# EAGLE schematic easySens-RS485-RND_455-00307-V002 (EAGLE 7.6.0)
MAPLE-CUx Large Version
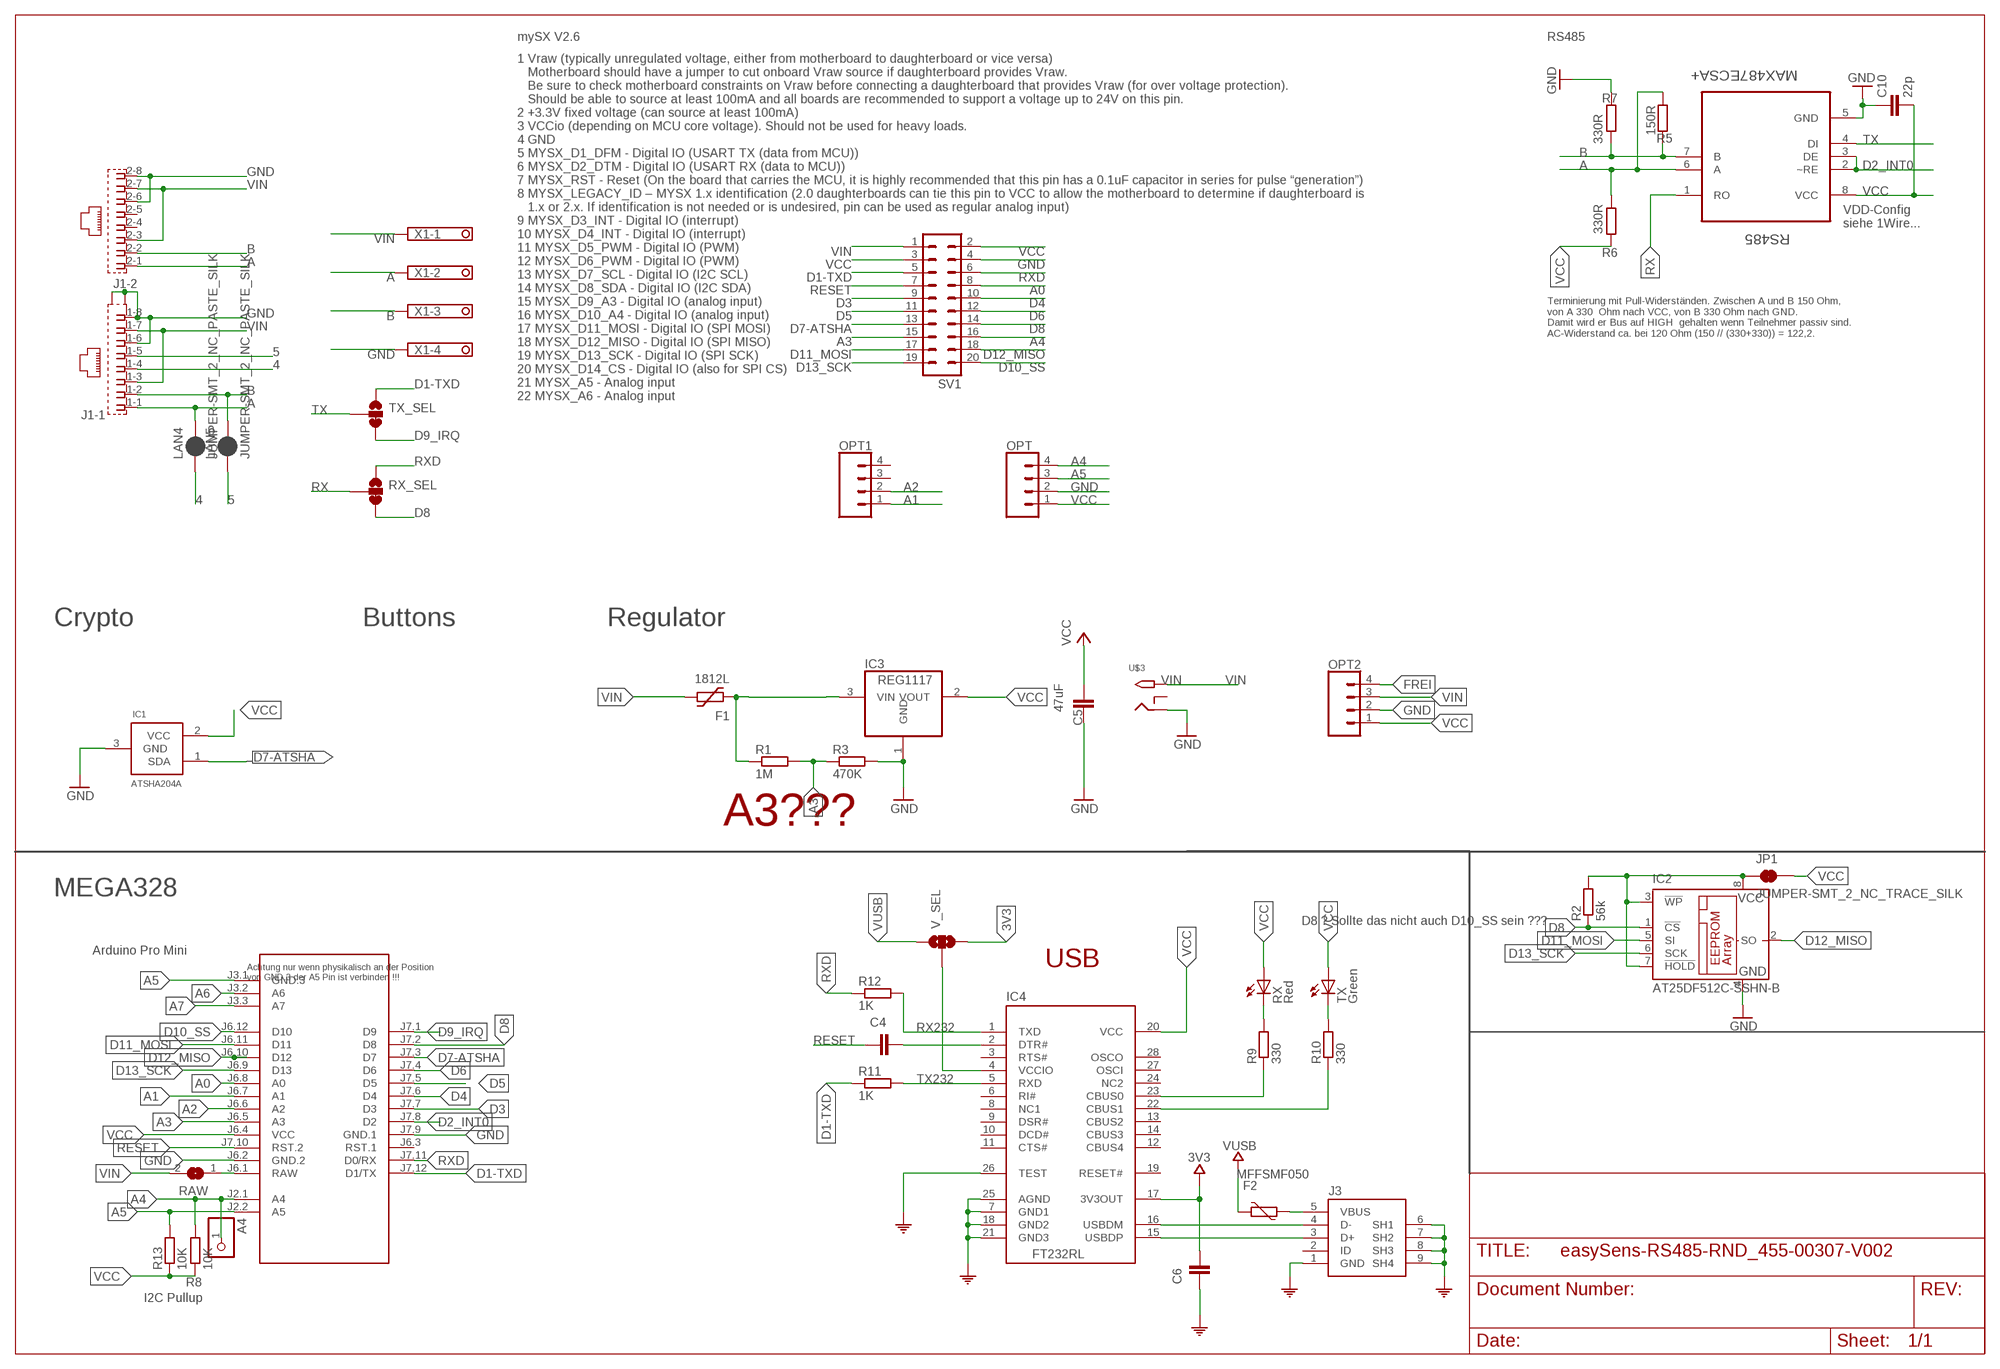
[diagram p0: schematic, sheet 1]

## Parts
A4  PINHD-1X1  [1X01]
C4  100nF  C-EUC0805  [C0805]
C5  47uF  C-EUC1210  [C1210]
C6  100nF  C-EUC0805  [C0805]
C10  22p  C-EUC0805  [C0805]
F1  1812L  [1812L]
F2  MFFSMF050  PTC  [0603-1608X90N]
IC1  ATSHA204A  [SOT23]
IC2  AT25DF512C-SSHN-B  25AA080SN  [SO-08]
IC3  REG1117  [SOT223]
IC4  FT232RL  0226_FT232RL  [SSOP28]
J1  RJ45_2X_NARROW_SHILDPINS  [RJ45_2X_NARROW_SHILDPINS]
J3  0219_14850  [USB-MINI-B_2]
JP1  JUMPER-SMT_2_NC_TRACE_SILK  [SMT-JUMPER_2_NC_TRACE_SILK]
LAN4  JUMPER-SMT_2_NC_PASTE_SILK  [SMT-JUMPER_2_NC_PASTE_SILK]
LAN5  JUMPER-SMT_2_NC_PASTE_SILK  [SMT-JUMPER_2_NC_PASTE_SILK]
M1  ARDUINO-PRO-MINI-3.3V#NP  [ARDUINO-PRO-MINI#NP]
OPT  CONN_04  [1X04]
OPT1  CONN_04  [1X04]
OPT2  CONN_04  [1X04]
R1  1M  R-EU_M0805  [M0805]
R2  56k  R-EU_M0805  [M0805]
R3  470K  R-EU_R0805  [R0805]
R5  150R  R-EU_R0805  [R0805]
R6  330R  R-EU_R0805  [R0805]
R7  330R  R-EU_R0805  [R0805]
R8  10K  R-EU_R0805  [R0805]
R9  330  R-EU_R0805  [R0805]
R10  330  R-EU_R0805  [R0805]
R11  1K  R-EU_R0805  [R0805]
R12  1K  R-EU_R0805  [R0805]
R13  10K  R-EU_R0805  [R0805]
RAW  SJ  [SJ]
RS485  MAX487ECSA+  [SOIC127P600X175-8N]
RX  Red  0181_KTP-2012SURCK  [CHIPLED_0805]
RX_SEL  JUMPER-SMT_3_1-NC_TRACE_SILK  [SMT-JUMPER_3_1-NC_TRACE_SILK]
SV1  MA10-2  [MA10-2]
TX  Green  0043_KPT-2012SGC  [CHIPLED_0805]
TX_SEL  JUMPER-SMT_3_1-NC_TRACE_SILK  [SMT-JUMPER_3_1-NC_TRACE_SILK]
U$3  2.1MMJACKTHM  [PJ-102A]
V_SEL  JUMPER-SMT_3_NO_SILK  [SMT-JUMPER_3_NO_SILK]
X1  1751264  [1751264]

## Nets
3V3: C6.2 IC4.17(3V3OUT) V_SEL.3
4: J1.1-4 LAN4.1
5: J1.1-5 LAN5.1
A: J1.1-1 J1.2-1 LAN4.2 R5.1 R6.2 RS485.6(A) X1.2
A0: M1.J6.8(A0) SV1.8
A1: M1.J6.7(A1) OPT1.1
A2: M1.J6.6(A2) OPT1.2
A3: M1.J6.5(A3) R1.2 R3.1 SV1.15
A4: A4.1 M1.J2.1(A4) OPT.4 R8.2 SV1.16
A5: M1.J2.2(A5) M1.J3.1(GND.3) OPT.3 R13.2
A6: M1.J3.2(A6)
A7: M1.J3.3(A7)
B: J1.1-2 J1.2-2 LAN5.2 R5.2 R7.1 RS485.7(B) X1.3
COM: C6.1 IC4.7(GND1) IC4.18(GND2) IC4.21(GND3) IC4.25(AGND) IC4.26(TEST) J3.1(GND) J3.6(SH1) J3.7(SH2) J3.8(SH3) J3.9(SH4)
D1-TXD: M1.J7.12(D1/TX) R11.1 SV1.5 TX_SEL.1
D2_INT0: M1.J7.8(D2) RS485.2(~RE) RS485.3(DE)
D3: M1.J7.7(D3) SV1.9
D4: M1.J7.6(D4) SV1.10
D5: M1.J7.5(D5) SV1.11
D6: M1.J7.4(D6) SV1.12
D7-ATSHA: IC1.1(SDA) M1.J7.3(D7) SV1.13
D8: IC2.1(!CS) M1.J7.2(D8) R2.1 RX_SEL.3 SV1.14
D9_IRQ: M1.J7.1(D9) TX_SEL.3
D10_SS: M1.J6.12(D10) SV1.20
D11_MOSI: IC2.5(SI) M1.J6.11(D11) SV1.17
D12_MISO: IC2.2(SO) M1.J6.10(D12) SV1.18
D13_SCK: IC2.6(SCK) M1.J6.9(D13) SV1.19
FREI: OPT2.4
GND [PWR]: C5.1 C10.1 IC1.3(GND) IC2.4(GND) IC3.1(GND) J1.1-6 J1.1-8 J1.2-6 J1.2-8 J1.G1(-1:S1) J1.G3(-1:S2) M1.J6.2(GND.2) M1.J7.9(GND.1) OPT2.2 OPT.2 R3.2 R7.2 RS485.5(GND) SV1.4 U$3.RING X1.4
N$1: IC4.4(VCCIO) V_SEL.2
N$2: IC4.22(CBUS1) R10.1
N$4: C4.2 IC4.2(DTR#)
N$5: IC4.15(USBDP) J3.3(D+)
N$6: IC4.16(USBDM) J3.4(D-)
N$7: R9.2 RX.C
N$8: IC4.23(CBUS0) R9.1
N$9: R10.2 TX.C
N$26: F2.2 J3.5(VBUS)
RAW1 [PWR]: M1.J6.1(RAW) RAW.1
RESET: C4.1 M1.J7.10(RST.2) SV1.7
RX: RS485.1(RO) RX_SEL.2
RX232: IC4.1(TXD) R12.2
RXD: M1.J7.11(D0/RX) R12.1 RX_SEL.1 SV1.6
TX: RS485.4(DI) TX_SEL.2
TX232: IC4.5(RXD) R11.2
VCC [PWR]: C5.2 C10.2 IC1.2(VCC) IC3.2(VOUT) IC4.20(VCC) JP1.2 M1.J6.4(VCC) OPT2.1 OPT.1 R6.1 R8.1 R13.1 RS485.8(VCC) RX.A SV1.2 SV1.3 TX.A
VCC1 [PWR]: IC2.3(!WP) IC2.7(!HOLD) IC2.8(VCC) JP1.1 R2.2
VIN [PWR]: F1.P$2 J1.1-3 J1.1-7 J1.2-3 J1.2-7 OPT2.3 RAW.2 SV1.1 U$3.TIP X1.1
VIN-FUSED [PWR]: F1.P$1 IC3.3(VIN) R1.1
VUSB: F2.1 V_SEL.1
Unconnected: IC4.3(RTS#) IC4.6(RI#) IC4.8(NC1) IC4.9(DSR#) IC4.10(DCD#) IC4.11(CTS#) IC4.12(CBUS4) IC4.13(CBUS2) IC4.14(CBUS3) IC4.19(RESET#) IC4.24(NC2) IC4.27(OSCI) IC4.28(OSCO) J1.2-4 J1.2-5 J3.2(ID) M1.J6.3(RST.1) OPT1.3 OPT1.4 U$3.RING_SW

## Notes on the sheet
- mySX V2.6 | RS485
- VDD-Config
  siehe 1Wire...
- Terminierung mit Pull-Widerständen. Zwischen A und B 150 Ohm,
  von A 330  Ohm nach VCC, von B 330 Ohm nach GND. 
  Damit wird er Bus auf HIGH  gehalten wenn Teilnehmer passiv sind.
  AC-Widerstand ca. bei 120 Ohm (150 // (330+330)) = 122,2.
- 1 Vraw (typically unregulated voltage, either from motherboard to daughterboard or vice versa)
     Motherboard should have a jumper to cut onboard Vraw source if daughterboard provides Vraw. 
     Be sure to check motherboard constraints on Vraw before connecting a daughterboard that provides Vraw (for over voltage protection). 
     Should be able to source at least 100mA and all boards are recommended to support a voltage up to 24V on this pin.
  2 +3.3V fixed voltage (can source at least 100mA)
  3 VCCio (depending on MCU core voltage). Should not be used for heavy loads.
  4 GND
  5 MYSX_D1_DFM - Digital IO (USART TX (data from MCU))
  6 MYSX_D2_DTM - Digital IO (USART RX (data to MCU))
  7 MYSX_RST - Reset (On the board that carries the MCU, it is highly recommended that this pin has a 0.1uF capacitor in series for pulse “generation”)
  8 MYSX_LEGACY_ID – MYSX 1.x identification (2.0 daughterboards can tie this pin to VCC to allow the motherboard to determine if daughterboard is 
     1.x or 2.x. If identification is not needed or is undesired, pin can be used as regular analog input)
  9 MYSX_D3_INT - Digital IO (interrupt)
  10 MYSX_D4_INT - Digital IO (interrupt)
  11 MYSX_D5_PWM - Digital IO (PWM)
  12 MYSX_D6_PWM - Digital IO (PWM)
  13 MYSX_D7_SCL - Digital IO (I2C SCL)
  14 MYSX_D8_SDA - Digital IO (I2C SDA)
  15 MYSX_D9_A3 - Digital IO (analog input)
  16 MYSX_D10_A4 - Digital IO (analog input)
  17 MYSX_D11_MOSI - Digital IO (SPI MOSI)
  18 MYSX_D12_MISO - Digital IO (SPI MISO)
  19 MYSX_D13_SCK - Digital IO (SPI SCK)
  20 MYSX_D14_CS - Digital IO (also for SPI CS)
  21 MYSX_A5 - Analog input
  22 MYSX_A6 - Analog input
- Crypto | Buttons | Regulator
- A3???
- MEGA328
- D8 ? Sollte das nicht auch D10_SS sein ???
- Arduino Pro Mini
- USB
- Achtung nur wenn physikalisch an der Position 
  von GND.3 der A5 Pin ist verbinden !!!
- I2C Pullup

## Library data of the parts
A4 = pinhead:PINHD-1X1: PIN HEADER
C4 C6 = resistor@1:C-EU: CAPACITOR, European symbol
C5 C10 = rcl:C-EU: CAPACITOR, European symbol
F1 = ptc-littlefuse:1812L
F2 = Arduino-rcl:PTC: SMD PTC; DATASHEET: http://www.bourns.com/docs/Product-Datasheets/mffsmf.pdf; DISTRIBUTOR-LINK: http://www.digikey.com/product-detail/en/bourns-inc/MF-FSMF050X-2/MF-FSMF050X-2CT-ND/2039389; DISTRIBUTOR-PN: MF-FSMF050X-2CT-ND; MANUFACTURER: Bourns Inc; MANUFACTURER-PN: MF-FSMF050X-2
IC1 = Sensor:ATSHA204A
IC2 = microchip:25*: Serial EEPROM 4K/ 8K , SPI bus; MF: MICROCHIP; MPN: 25AA080/SN; OC_FARNELL: 1816072; OC_NEWARK: 92C7351
IC3 = burr-brown:REG1117: 800mA and 1A Low Dropout (LDO) Positive Regulator 1.8V, 2.5V, 2.85V, 3.3V, 5V, and Adj; MPN: REG1117; OC_FARNELL: 1097566; OC_NEWARK: 14P6981
IC4 = IntegratedCircuits:0226_FT232RL: USB to serial UART interface -FT232RL; CASE: SSOP28; MONTHLY_USAGE: _____; PART_NUMBER: FT232RL; PRICE: _____; SUPPLIER: _____; TYPE: Circuito_Integrato
J1 = RJ45:RJ45_2X_NARROW_SHILDPINS: RJ45 connector
J3 = Connettori:0219_14850: Usb-Mini F 90 Smd; MONTHLY_USAGE: _____; PART_NUMBER: 14850; PRICE: _____; SUPPLIER: _____; TYPE: Connettori; VALUE: USB-mini-90 -SMD
JP1 = SparkFun-Jumpers:JUMPER-SMT_2_NC_TRACE: Normally closed trace jumper This jumper has a trace between two pads so it's normally closed (NC). Use a razor knife to open the connection. For best results follow the IPC guidelines for cutting traces: Cutout at least 0.063 mm (0.005 in). Remove all loose material to clean up the cut area. Seal the cut with an approved epoxy. Reapply solder to reclose the connection.
LAN4 LAN5 = SparkFun-Jumpers:JUMPER-SMT_2_NC_PASTE: Normally closed solder jumper This jumper has an aperture in the stencil to allow solder paste to bridge the split in the wire so it's normally closed (NC). Wick off the solder to open the connection. Reapply solder to reclose the connection.
M1 = diy-modules:ARDUINO-PRO-MINI-*#NP: Arduino Pro Mini without programming pads
OPT OPT1 OPT2 = SparkFun-Connectors:CONN_04: Multi connection point. Often used as Generic Header-pin footprint for 0.1 inch spaced/style header connections On any of the 0.1 inch spaced packages, you can populate with these: Break Away Headers - Straight <https://www.sparkfun.com/products/116> (PRT-00116) Break Away Male Headers - Right Angle <https://www.sparkfun.com/products/553> (PRT-00553) Female Headers <https://www.sparkfun.com/products/115> (PRT-00115) Break Away Headers - Machine Pin <https://www.sparkfun.com/products/117> (PRT-00117) Break Away Female Headers - Swiss Machine Pin <https://www.sparkfun.com/products/743> (PRT-00743) For SCREWTERMINALS and SPRING TERMINALS visit here: Screw Terimnals on SparkFun.com <https://www.sparkfun.com/search/results?term=Screw+Terminals> (5mm/3.5mm/2.54mm spacing) This device is also useful as a general connection point to wire up your design to another part of your project. Our various solder wires solder well into these plated through hole pads. Hook-Up Wire - Assortment (Stranded, 22 AWG) <https://www.sparkfun.com/products/11375> (PRT-11375) Hook-Up Wire - Assortment (Solid Core, 22 AWG) <https://www.sparkfun.com/products/11367> (PRT-11367) View the entire wire category on our website here <https://www.sparkfun.com/categories/141> Special notes: Molex polarized connector foot print use with SKU : PRT-08231 with associated crimp pins and housings. 1MM SMD Version SKU: PRT-10208; PROD_ID: CONN-09696
R1 R3 R5-R8 R13 = rcl:R-EU_: RESISTOR, European symbol
R2 = resistor:R-EU_: RESISTOR, European symbol
R9-R12 = resistor@1:R-EU_: RESISTOR, European symbol
RAW = jumper:SJ: SMD solder JUMPER
RS485 = Maxim_By_element14_Batch_1:MAX487ECSA+: Low-Power, Slew-Rate-Limited RS-485/RS-422 Transceivers; MPN: MAX487ECSA+; OC_FARNELL: 9724532; OC_NEWARK: 68K4803; PACKAGE: SOIC-8; SUPPLIER: Maxim
RX = Opto:0181_KTP-2012SURCK: LED RED - SMD - 0805; MONTHLY_USAGE: _____; PART_NUMBER: KTP-2012SURCK; PRICE: _____; SUPPLIER: _____; TYPE: Opto
RX_SEL TX_SEL = SparkFun-Jumpers:JUMPER-SMT_3_1-NC_TRACE: Normally closed trace jumper (1 of 2 connections) This jumper has a trace between two pads so it's normally closed (NC). The other connection is normally open (NO). Use a razor knife to open the connection. For best results follow the IPC guidelines for cutting traces: Cutout at least 0.063 mm (0.005 in). Remove all loose material to clean up the cut area. Seal the cut with an approved epoxy. Reapply solder to reclose the connection, or to close the NO connection.
SV1 = con-lstb:MA10-2: PIN HEADER; OC_FARNELL: unknown; OC_NEWARK: unknown
TX = Opto:0043_KPT-2012SGC: LED GREEN - SMD-0805; MONTHLY_USAGE: _____; PART_NUMBER: KPT-2012SGC; PRICE: _____; SUPPLIER: _____; TYPE: Opto
U$3 = adafruit:2.1MMJACK: 2.1mm x 5.5mm THM DC jack with internal switch. Digikey part #PJ-102A, 4UCON part #05537 2.1mm x 5.5mm SMT DC jack with internal switch. Digikey part #PJ-002A-SMT, 4UCON part #03267 By microbuilder.eu & adafruit.com
V_SEL = SparkFun-Jumpers:JUMPER-SMT_3_NO: Normally open jumper This jumper has three pads in close proximity to each other. Apply solder to close the connection(s).
X1 = con-phoenix-350:1751264: MKDS 1/ 4-3,5 Printklemme Nennstrom: 10 A Bemessungsspannung: 160 V Raster: 3,5 mm Polzahl: 4 Montageart: Löten Anschlussart: Schraubanschluss Anschlussrichtung vom Leiter zur Platine: 0° Source: http://eshop.phoenixcontact.com .. 1751264.pdf; MPN: 1751264; OC_FARNELL: unknown; OC_NEWARK: 10R0934

## Net classes
0 default: width 0.254 mm
1 PWR: width 0.406 mm